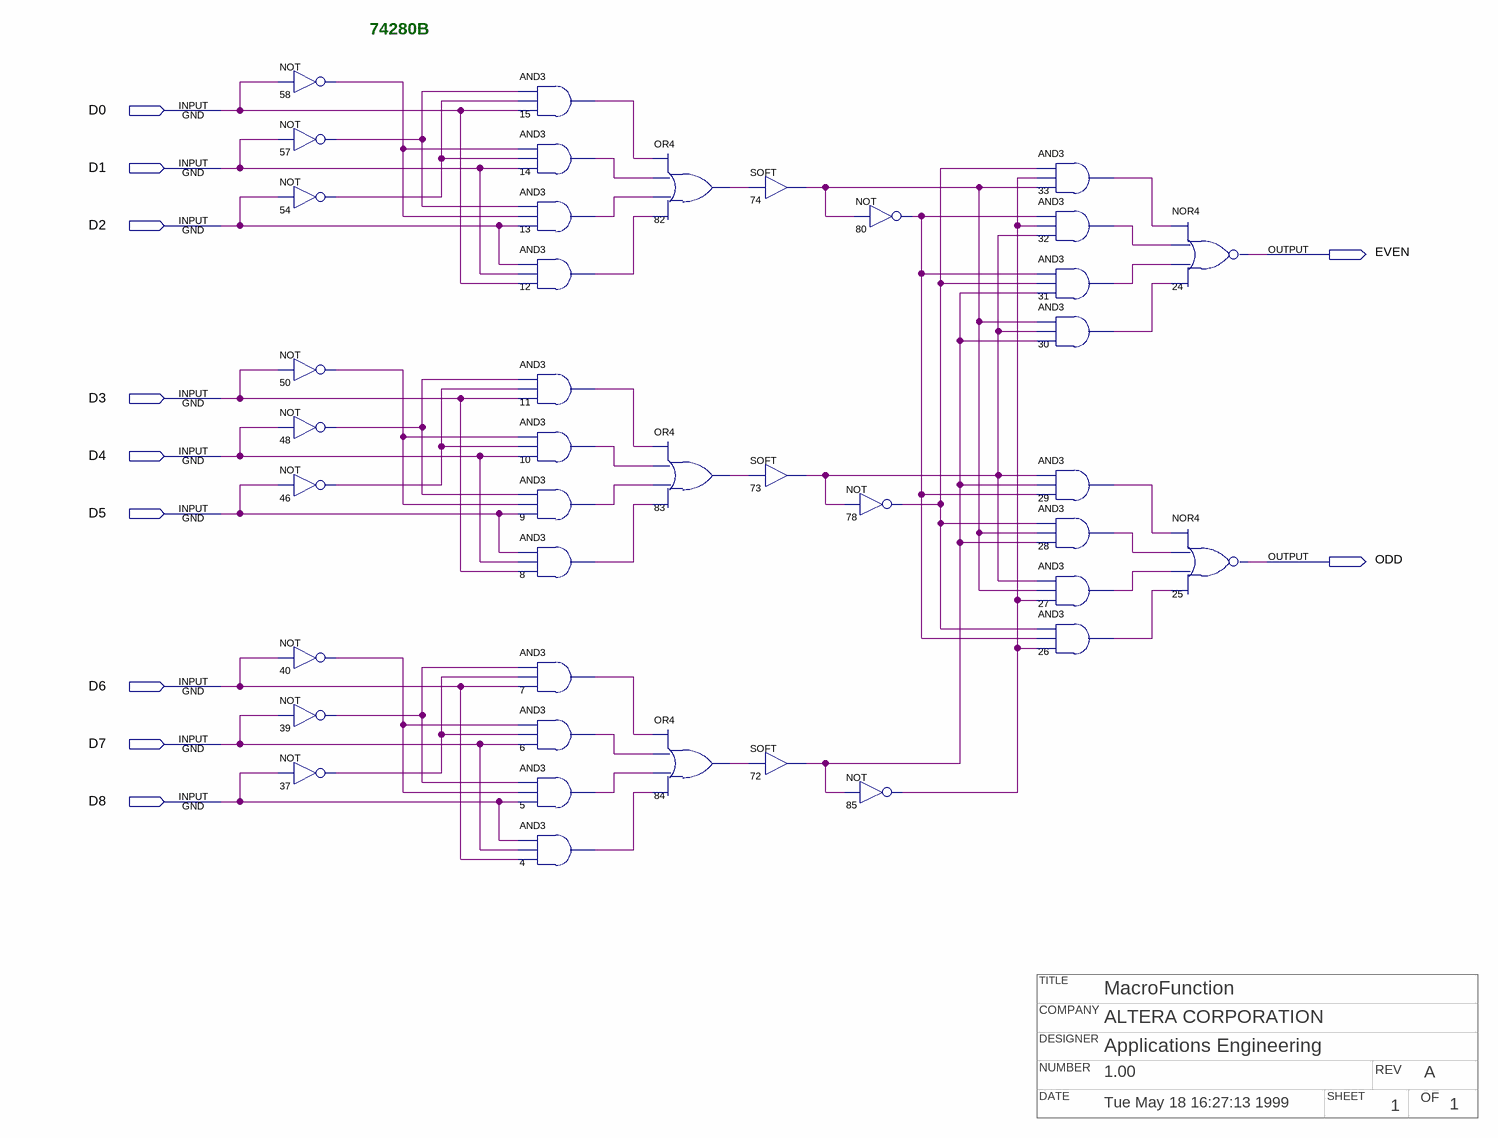
[diagram p0: schematic sheet]
// Quartus schematic 74280b.bdf as structural Verilog: 40 symbols, 11 pins
// Title block: TITLE: MacroFunction; COMPANY: ALTERA CORPORATION; DESIGNER: Applications Engineering; NUMBER: 1.00; REV: A; DATE: Tue May 18 16:27:13 1999; SHEET: 1; OF: 1
module \74280b  (
  input  D0,
  input  D1,
  input  D2,
  input  D3,
  input  D4,
  input  D5,
  input  D6,
  input  D7,
  input  D8,
  output EVEN,
  output ODD
);

  wire n4_out, n5_out, n6_out, n7_out, n8_out, n9_out, n10_out, n11_out, n12_out, n13_out, n14_out, n15_out,
       n26_out, n27_out, n28_out, n29_out, n30_out, n31_out, n32_out, n33_out, n37_out, n39_out, n40_out,
       n46_out, n48_out, n50_out, n54_out, n57_out, n58_out, n72_out, n73_out, n74_out, n78_out, n80_out,
       n82_out, n83_out, n84_out, n85_out;

  not u_58 (n58_out, D0);
  not u_57 (n57_out, D1);
  not u_54 (n54_out, D2);
  not u_50 (n50_out, D3);
  not u_48 (n48_out, D4);
  not u_46 (n46_out, D5);
  not u_40 (n40_out, D6);
  not u_39 (n39_out, D7);
  not u_37 (n37_out, D8);
  and u_15 (n15_out, n57_out, n54_out, D0);
  and u_14 (n14_out, n58_out, n54_out, D1);
  and u_13 (n13_out, n57_out, n58_out, D2);
  and u_12 (n12_out, D2, D1, D0);
  and u_11 (n11_out, n48_out, n46_out, D3);
  and u_10 (n10_out, n50_out, n46_out, D4);
  and u_9 (n9_out, n48_out, n50_out, D5);
  and u_8 (n8_out, D5, D4, D3);
  and u_7 (n7_out, n39_out, n37_out, D6);
  and u_6 (n6_out, n40_out, n37_out, D7);
  and u_5 (n5_out, n39_out, n40_out, D8);
  and u_4 (n4_out, D8, D7, D6);
  or u_82 (n82_out, n15_out, n14_out, n13_out, n12_out);
  or u_83 (n83_out, n11_out, n10_out, n9_out, n8_out);
  or u_84 (n84_out, n7_out, n6_out, n5_out, n4_out);
  SOFT u_74 (.IN(n82_out), .OUT(n74_out));
  SOFT u_73 (.IN(n83_out), .OUT(n73_out));
  SOFT u_72 (.IN(n84_out), .OUT(n72_out));
  not u_78 (n78_out, n73_out);
  not u_85 (n85_out, n72_out);
  not u_80 (n80_out, n74_out);
  and u_33 (n33_out, n78_out, n85_out, n74_out);
  and u_32 (n32_out, n80_out, n85_out, n73_out);
  and u_31 (n31_out, n80_out, n78_out, n72_out);
  and u_30 (n30_out, n74_out, n73_out, n72_out);
  and u_29 (n29_out, n73_out, n72_out, n80_out);
  and u_28 (n28_out, n78_out, n74_out, n72_out);
  and u_27 (n27_out, n73_out, n74_out, n85_out);
  and u_26 (n26_out, n78_out, n80_out, n85_out);
  nor u_24 (EVEN, n33_out, n32_out, n31_out, n30_out);
  nor u_25 (ODD, n29_out, n28_out, n27_out, n26_out);

  // Notes on the sheet:
  //   74280B
endmodule
